# EAGLE design watch_game_2022_revB (EAGLE 8.7.1)
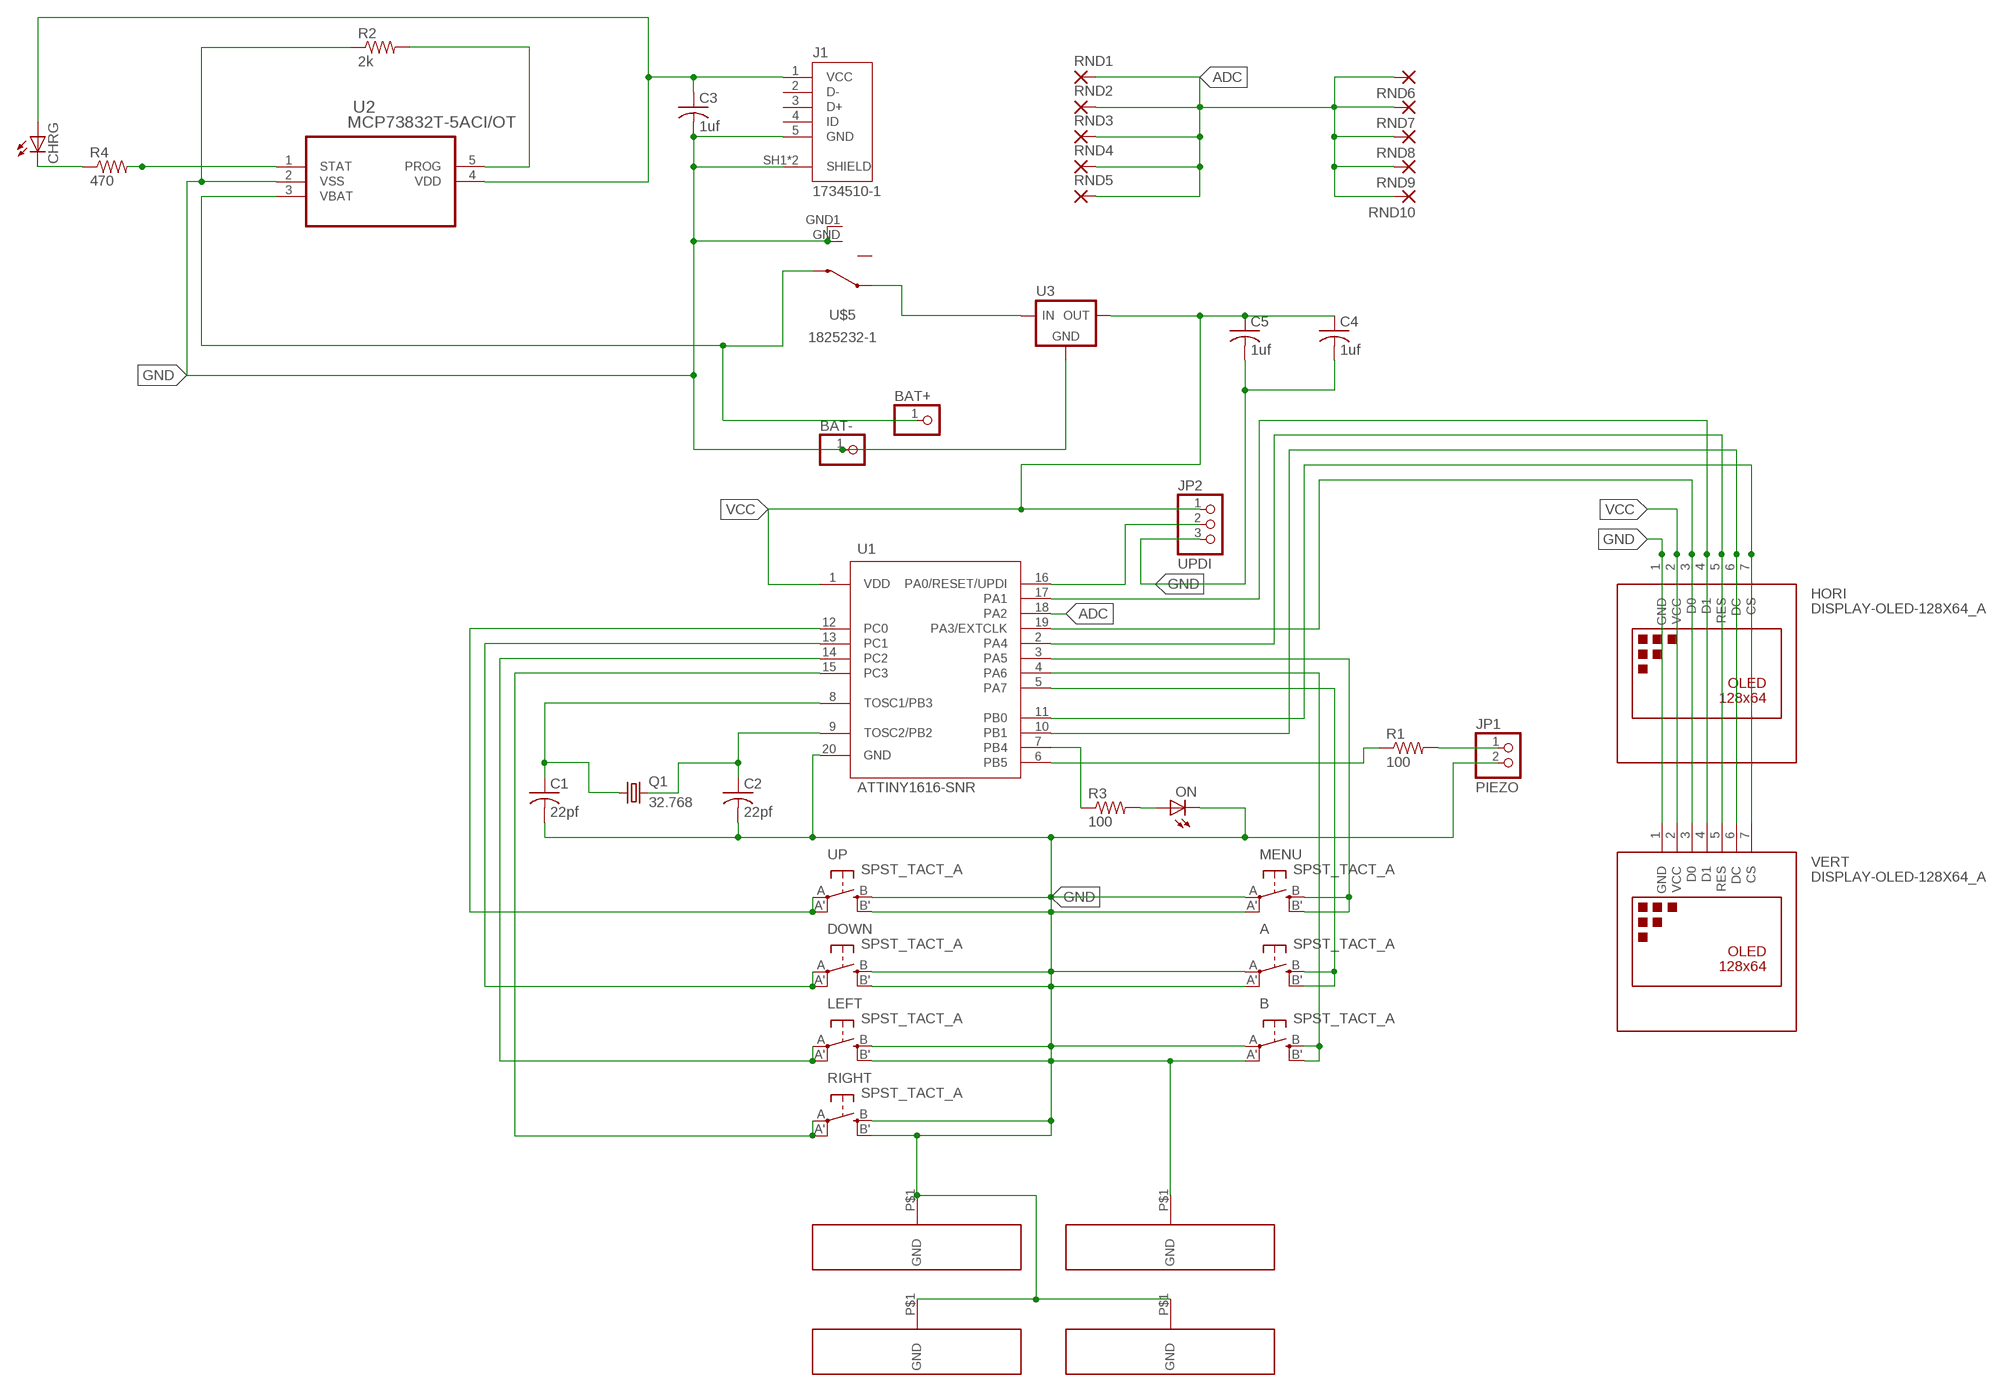
[diagram p0: schematic, sheet 1]

## Parts
A  SPST_TACT_A  [EVQ-Q2_A]
B  SPST_TACT_A  [EVQ-Q2_A]
BAT+  PINHD-1X1  [1X01]
BAT-  PINHD-1X1  [1X01]
C1  22pf  C-USC0805  [C0805]
C2  22pf  C-USC0805  [C0805]
C3  1uf  C-USC0805  [C0805]
C4  1uf  C-USC0805  [C0805]
C5  1uf  C-USC0805  [C0805]
CHRG  LED3MM  [LED3MM]
DOWN  SPST_TACT_A  [EVQ-Q2_A]
HORI  DISPLAY-OLED-128X64_A  [DISPLAY-OLED-128X64_A]
J1  1734510-1  [TE_1734510-1]
JP1  PIEZO  PINHD-1X2  [1X02]
JP2  UPDI  PINHD-1X3  [1X03]
LEFT  SPST_TACT_A  [EVQ-Q2_A]
MENU  SPST_TACT_A  [EVQ-Q2_A]
ON  LED5MM  [LED5MM]
Q1  32.768  CRYSTALTC26H  [TC26H]
R1  100  R-US_M0805  [M0805]
R2  2k  R-US_M0805  [M0805]
R3  100  R-US_M0805  [M0805]
R4  470  R-US_M0805  [M0805]
RIGHT  SPST_TACT_A  [EVQ-Q2_A]
RND1  SMD5  [SMD2,54-5,08]
RND2  SMD5  [SMD2,54-5,08]
RND3  SMD5  [SMD2,54-5,08]
RND4  SMD5  [SMD2,54-5,08]
RND5  SMD5  [SMD2,54-5,08]
RND6  SMD5  [SMD2,54-5,08]
RND7  SMD5  [SMD2,54-5,08]
RND8  SMD5  [SMD2,54-5,08]
RND9  SMD5  [SMD2,54-5,08]
RND10  SMD5  [SMD2,54-5,08]
U1  ATTINY1616-SNR  [SOIC127P1032X265-20N]
U2  MCP73832T-5ACI/OT  [SOT95P300X145-5N]
U3  LF50CDT  [DPAK]
U$5  1825232-1  [1825232-1]
U$6  GND_STRIP_600MIL  [GND_PADS_2]
U$7  GND_STRIP_600MIL  [GND_PADS_2]
U$8  GND_STRIP_600MIL  [GND_PADS_2]
U$9  GND_STRIP_600MIL  [GND_PADS_2]
UP  SPST_TACT_A  [EVQ-Q2_A]
VERT  DISPLAY-OLED-128X64_A  [DISPLAY-OLED-128X64_A]

## Nets
ADC: RND1.1(P) RND2.1(P) RND3.1(P) RND4.1(P) RND5.1(P) RND6.1(P) RND7.1(P) RND8.1(P) RND9.1(P) RND10.1(P) U1.18(PA2)
GND: A.A'(P1) A.A(P) B.A'(P1) B.A(P) BAT-.1 C1.2 C2.2 C3.2 C4.2 C5.2 DOWN.B'(S1) DOWN.B(S) HORI.1(GND) J1.5(GND) J1.SH1(SHIELD) J1.SH2(SHIELD) JP1.2 JP2.3 LEFT.B'(S1) LEFT.B(S) MENU.A'(P1) MENU.A(P) ON.K(C) R2.1 RIGHT.B'(S1) RIGHT.B(S) U1.20(GND) U2.2(VSS) U3.4(GND) U$5.GND U$5.GND1 U$6.P$1(GND) U$7.P$1(GND) U$8.P$1(GND) U$9.P$1(GND) UP.B'(S1) UP.B(S) VERT.1(GND)
N$1: U1.12(PC0) UP.A'(P1) UP.A(P)
N$2: DOWN.A'(P1) DOWN.A(P) U1.13(PC1)
N$3: LEFT.A'(P1) LEFT.A(P) U1.14(PC2)
N$4: RIGHT.A'(P1) RIGHT.A(P) U1.15(PC3)
N$5: B.B'(S1) B.B(S) U1.4(PA6)
N$6: HORI.3(D0) U1.19(PA3/EXTCLK) VERT.3(D0)
N$7: R3.1 U1.7(PB4)
N$8: JP1.1 R1.2
N$9: C3.1 CHRG.A J1.1(VCC) U2.4(VDD)
N$10: U3.1(VIN) U$5.3
N$11: R4.2 U2.1(STAT)
N$12: BAT+.1 U2.3(VBAT) U$5.2
N$13: JP2.2 U1.16(PA0/RESET/UPDI)
N$14: HORI.4(D1) U1.17(PA1) VERT.4(D1)
N$16: HORI.5(RES) U1.2(PA4) VERT.5(RES)
N$17: MENU.B'(S1) MENU.B(S) U1.3(PA5)
N$18: ON.A R3.2
N$19: A.B'(S1) A.B(S) U1.5(PA7)
N$20: HORI.7(CS) U1.11(PB0) VERT.7(CS)
N$21: HORI.6(DC) U1.10(PB1) VERT.6(DC)
N$23: R1.1 U1.6(PB5)
N$24: C1.1 Q1.1 U1.8(TOSC1/PB3)
N$25: C2.1 Q1.2 U1.9(TOSC2/PB2)
N$26: R2.2 U2.5(PROG)
N$27: CHRG.K(C) R4.1
VCC: C4.1 C5.1 HORI.2(VCC) JP2.1 U1.1(VDD) U3.3(VOUT) VERT.2(VCC)
Unconnected: J1.2(D-) J1.3(D+) J1.4(ID) U$5.1

## Library data of the parts
A B DOWN LEFT MENU RIGHT UP = adafruit:SPST_TACT_A: SMT 6mm switch, EVQQ2 series http://www.ladyada.net/library/eagle
BAT+ BAT- = adafruit:PINHD-1X1: Pin header 1x1 for 0.1" spacing With round pins
C1 C2 = adafruit:C-US: CAPACITOR, American symbol
C3-C5 = rcl:C-US: CAPACITOR, American symbol; SPICEPREFIX: C
CHRG = adafruit:LED: LED
HORI VERT = diy-modules:DISPLAY-OLED-128X64_A: 128x64 Dot Matrix OLED Module based on SSD1306 chip Variant with SPI interface More details available here: http://www.instructables.com/id/How-to-use-OLED-display-arduino-module/ SSD1306 datasheet: https://cdn-shop.adafruit.com/datasheets/SSD1306.pdf Click here to find device on ebay.com <http://www.ebay.com/sch/oled+display+128x64> Note: There are two variants: I2C and SPI. Search for the proper version.
J1 = USB 1734510-1:1734510-1: Conn Mini USB Type B RCP 5 POS 1.6mm Solder RA Thru-Hole 5 Terminal 1 Port Tray Check prices <https://pricing.snapeda.com/parts/1734510-1/TE%20Connectivity/view-part?ref=eda>; AVAILABILITY: In Stock; COMMENT: 1734510-1; DESCRIPTION: Conn Mini USB Type B RCP 5 POS 1.6mm Solder RA Thru-Hole 5 Terminal 1 Port Tray; MF: TE Connectivity; MP: 1734510-1; PACKAGE: None; PRICE: None; PURCHASE-URL: https://pricing.snapeda.com/search/part/1734510-1/?ref=eda
JP1 = pinhead:PINHD-1X2: PIN HEADER
JP2 = pinhead:PINHD-1X3: PIN HEADER
ON = led:LED: LED
Q1 = adafruit:CRYSTAL: CRYSTAL; OC_FARNELL: unknown; OC_NEWARK: unknown
R1-R4 = resistor:R-US_: RESISTOR, American symbol
RND1-RND10 = wirepad:SMD5: SMD PAD
U1 = ATTINY1616-SNR:ATTINY1616-SNR: ATTiny1616 is a 20 pin Microcontroller with: - 5 selectable Voltage reference - 8 bit Dac - Multiplexable IOs(SPI, UART, I2C) And much more Datasheet <http://ww1.microchip.com/downloads/en/DeviceDoc/ATtiny1616-3216-DataSheet-DS40001997C.pdf> Check prices <https://pricing.snapeda.com/parts/ATTINY1616-SNR/Microchip/view-part?ref=eda>; AVAILABILITY: In Stock; DESCRIPTION: AVR tinyAVR™ 1, Functional Safety (FuSa) Microcontroller IC 8-Bit 20MHz 16KB (16K x 8) FLASH 20-SOIC; MF: Microchip; MP: ATTINY1616-SNR; PACKAGE: SOIC-20 Microchip; PRICE: None; PURCHASE-URL: https://pricing.snapeda.com/search/part/ATTINY1616-SNR/?ref=eda
U2 = MCP73832T-5ACI_OT:MCP73832T-5ACI/OT: IC, BATT CHARGER, Li-Ion Li-Polymer, 500 mA Check availability <https://pricing.snapeda.com/parts/MCP73832T-5ACI/OT/Microchip/view-part?ref=eda>; AVAILABILITY: In Stock; DESCRIPTION: Charger IC Lithium Ion/Polymer SOT-23-5; MF: Microchip; MP: MCP73832T-5ACI/OT; PACKAGE: SOT-23 Microchip; PRICE: None; PURCHASE-URL: https://pricing.snapeda.com/search/part/MCP73832T-5ACI/OT/?ref=eda
U3 = bt_regulator:LF50CDT: 5V LDO Voltage Regulator Very low-dropout voltage (0.45 V) Very low quiescent current (typ. 50 µA in OFF mode, 500 µA in ON mode) Output current up to 500 mA Logic-controlled electronic shutdown Output voltages of 1.5; 1.8; 2.5; 3.3; 4.7; 5; 6; 8; 8.5; 9; 12 V Automotive grade product: 1.8 V, 2.5 V, 3.3 V 5.0 V, 8.0 V, 8.5 V VOUT in DPAK and PPAK packages Internal current and thermal limit Only 2.2 µF for stability Available in ±1% (AB), ± 1.5% (AC) or ± 2% (C) selection at 25 °C Supply voltage rejection: 80 db (typ.) Temperature range: from -40 to 125 °C The LFxxAB/LFxxC are very low drop regulators available in PENTAWATT, TO-220, TO-220FP, DPAK and PPAK package and in a wide range of output voltages. The very low drop voltage (0.45 V) and the very low quiescent current make them particularly suitable for low noise, low power applications and specially in battery powered systems Datasheet.pdf <http://www.st.com/web/en/resource/technical/document/datasheet/CD00000546.pdf>
U$5 = switch 1825232-1:1825232-1: Check prices <https://pricing.snapeda.com/parts/1825232-1/TE%20Connectivity/view-part?ref=eda>; AVAILABILITY: In Stock; COMMENT: 1825232-1; DESCRIPTION: Switch Slide ON None ON SPDT Side Slide 0.2A 30VDC 10000Cycle PC Pins Bracket Mount/Through Hole; EU_ROHS_COMPLIANCE: Compliant; MF: TE Connectivity; MP: 1825232-1; PACKAGE: None; PRICE: None; PURCHASE-URL: https://pricing.snapeda.com/search/part/1825232-1/?ref=eda
U$6-U$9 = Atari Vagabond:GND_STRIP_600MIL

## Board
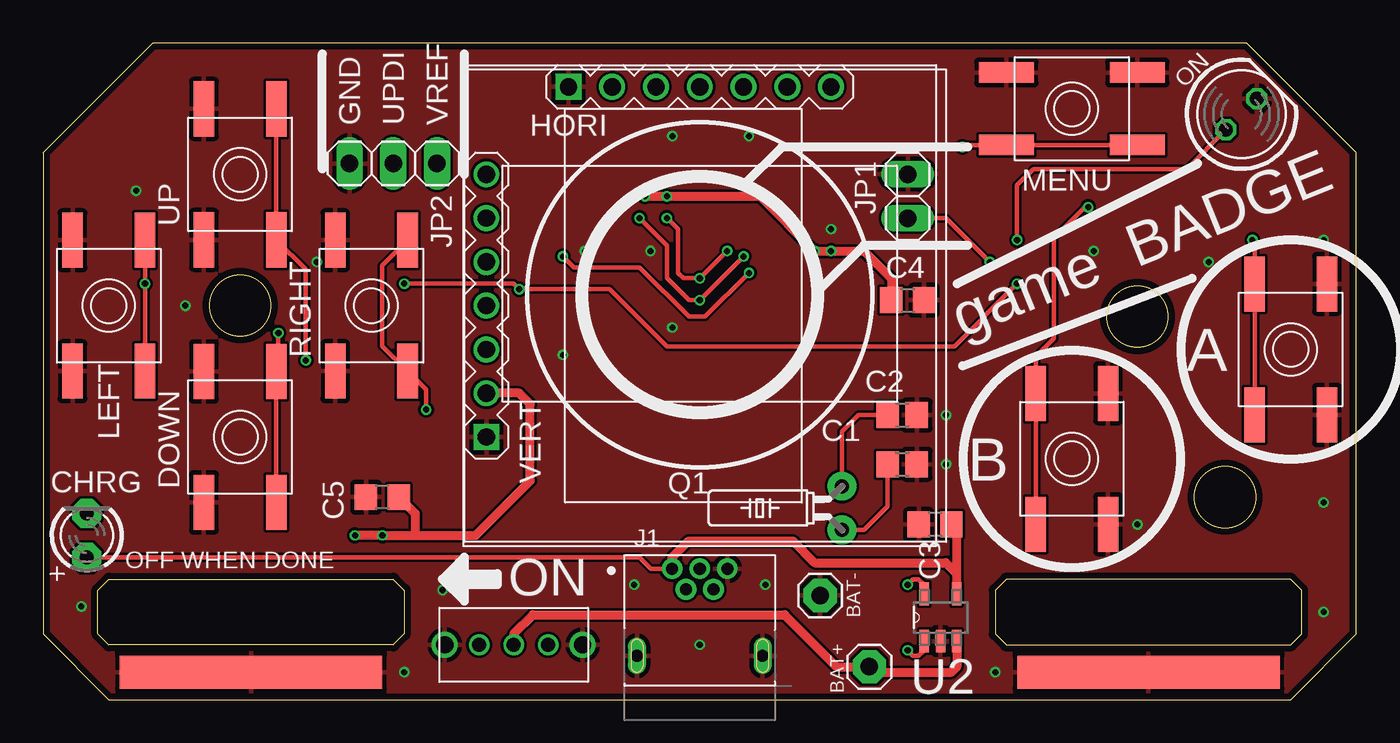
[diagram p1: board, top side]
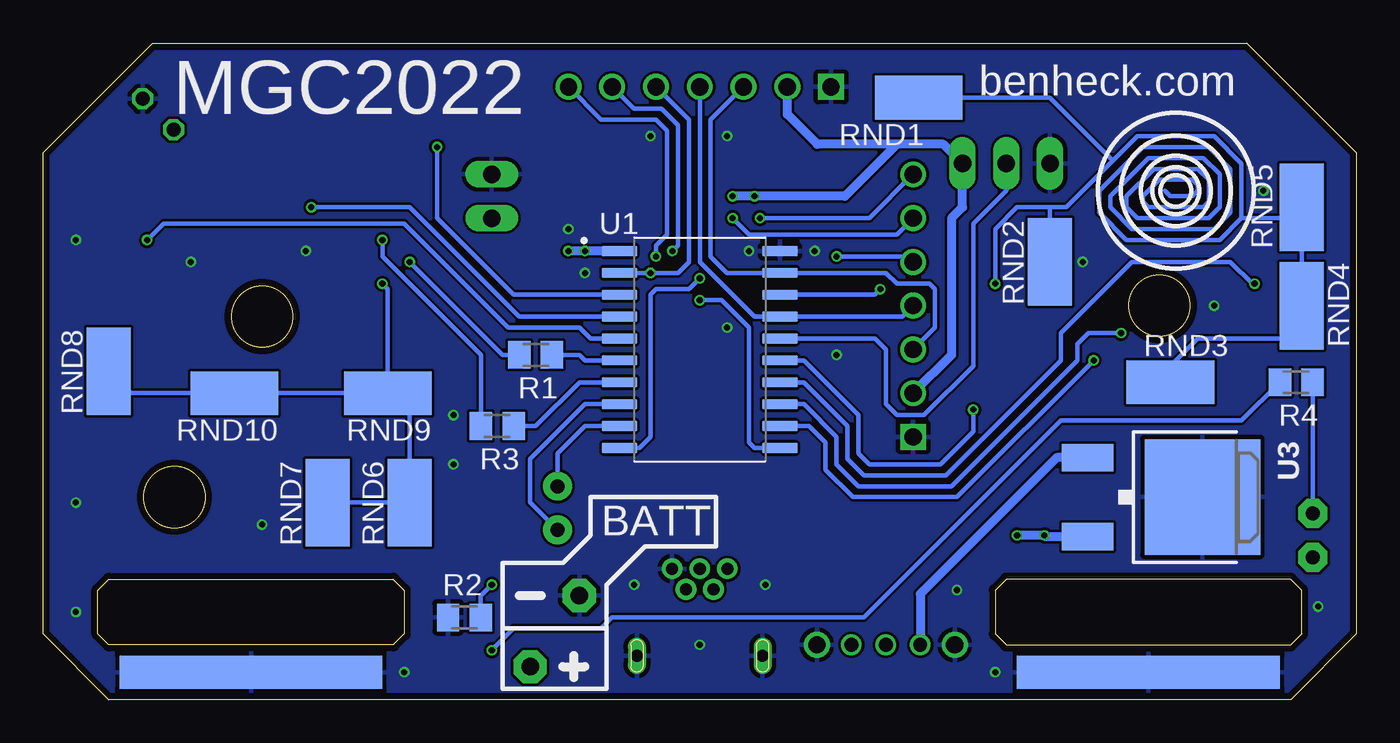
[diagram p2: board, bottom side, seen from below]

Size 76.2 x 38.1 mm. Coordinates in mm from the lower left corner, seen from the top.
Outline: 3.81,0 72.39,0 76.2,3.81 76.2,31.75 69.85,38.1 6.35,38.1 0,31.75 0,3.81 3.81,0
Outline: 3.17,3.81 3.17,6.35 3.81,6.99 20.32,6.99 20.95,6.35 20.95,3.81 20.32,3.17 3.81,3.17 3.17,3.81
Outline: 55.24,6.35 55.24,3.81 55.88,3.17 72.39,3.17 73.03,3.81 73.03,6.35 72.39,6.99 55.88,6.99 55.24,6.35
Outline: circle at 11.43,22.86 radius 1.78
Outline: circle at 68.58,11.75 radius 1.78
Outline: circle at 63.5,22.23 radius 1.78
Copper layers (1*16): Top 0.035559375mm / dielectric 1.6mm / Bottom 0.035559375mm
Design rules "oshpark-2layer": minimum track width 6mil, minimum drill 10mil, track to track 6mil, track to pad 6mil, pad to pad 6mil, via to via 6mil, smd to smd 6mil, copper to edge 15mil, drill to drill 6mil, minimum pad ring 5mil, minimum via ring 5mil, stop-mask expansion 2.5mil, vias tented up to drill 0mil, thermal gap 10mil

### Footprints (pad centres in the part's own frame; a part is rotated, then mirrored left to right if it is on the bottom)
EVQ-Q2_A = smd 3.2 x 1.2: A -3.8,-2.1; A' 3.8,-2.1; B -3.8,2.1; B' 3.8,2.1
1X01 = drill 1.016 pad 1.93 octagon: 1 0,0
C0805 = smd 1.3 x 1.5: 1 -0.85,0; 2 0.85,0
C0805' = smd 1.3 x 1.5: 1 -0.95,0; 2 0.95,0
LED3MM = drill 0.813 pad 1.676 octagon: A -1.27,0; K 1.27,0
DISPLAY-OLED-128X64_A = drill 1 square: 1 -7.62,12.7 | drill 1: 2 -5.08,12.7; 3 -2.54,12.7; 4 0,12.7; 5 2.54,12.7; 6 5.08,12.7; 7 7.62,12.7
TE_1734510-1 = drill 0.7 pad 1.2: 1 -1.6,5.05; 2 -0.8,3.85; 3 0,5.05; 4 0.8,3.85; 5 1.6,5.05 | drill 0.7 long: SH1 3.65,0; SH2 -3.65,0
1X02 = drill 1.016 long: 1 -1.27,0; 2 1.27,0
1X03 = drill 1.016 long: 1 -2.54,0; 2 0,0; 3 2.54,0
LED5MM = drill 0.813 octagon: A -1.27,0; K 1.27,0
TC26H = drill 0.813 pad 1.676: 1 -1.27,0; 2 1.27,0
M0805 = smd 1.3 x 1.6: 1 -0.95,0; 2 0.95,0
SMD2,54-5,08 = smd 2.54 x 5.08: 1 0,0
SOIC127P1032X265-20N = smd 2.05 x 0.6: 1 -4.655,5.715; 2 -4.655,4.445; 3 -4.655,3.175; 4 -4.655,1.905; 5 -4.655,0.635; 6 -4.655,-0.635; 7 -4.655,-1.905; 8 -4.655,-3.175; 9 -4.655,-4.445; 10 -4.655,-5.715; 11 4.655,-5.715; 12 4.655,-4.445; 13 4.655,-3.175; 14 4.655,-1.905; 15 4.655,-0.635; 16 4.655,0.635; 17 4.655,1.905; 18 4.655,3.175; 19 4.655,4.445; 20 4.655,5.715
SOT95P300X145-5N = smd 1.321 x 0.559: 1 -1.372,0.94; 2 -1.372,0; 3 -1.372,-0.94; 4 1.372,-0.94; 5 1.372,0.94
DPAK = smd 1.6 x 3: 1 -2.3,-4.8; 3 2.3,-4.8 | smd 6.7 x 6.7: 4 0,1.86
1825232-1 = drill 0.8: 1 -2,0; 2 0,0; 3 2,0 | drill 1: GND -4,0; GND1 4,0
GND_PADS_2 = smd 15.24 x 1.905: P$1 0,0

### Placement (x,y rotation side)
A  72.39,20.32 90 top
B  59.69,13.97 90 top
BAT+  47.94,1.91 0 top
BAT-  45.09,6.03 0 top
C1  49.85,13.65 0 top
C2  49.85,16.51 0 top
C3  1uf  [C0805']  51.75,10.16 180 top
C4  1uf  [C0805']  50.16,23.18 0 top
C5  1uf  [C0805']  19.68,11.75 180 top
CHRG  2.54,9.53 90 top
DOWN  11.43,15.24 90 top
HORI  38.1,22.86 0 top
J1  38.1,2.54 0 top
JP1  50.16,29.21 90 top
JP2  20.32,31.11 180 top
LEFT  3.81,22.86 90 top
MENU  59.69,34.29 180 top
ON  69.53,33.97 45 top
Q1  46.35,11.11 90 top
R1  47.62,20 180 bottom
R2  51.75,4.76 0 bottom
R3  49.85,15.88 180 bottom
R4  3.49,18.41 180 bottom
RIGHT  19.05,22.86 90 top
RND1  25.4,34.92 90 bottom
RND2  17.78,25.4 0 bottom
RND3  10.79,18.41 270 bottom
RND4  3.17,22.86 180 bottom
RND5  3.17,28.57 180 bottom
RND6  54.93,11.43 0 bottom
RND7  59.69,11.43 0 bottom
RND8  72.39,19.05 0 bottom
RND9  56.2,17.78 90 bottom
RND10  65.09,17.78 90 bottom
U1  38.1,20.32 0 bottom
U2  52.07,4.76 90 top
U3  10.79,11.75 270 bottom
U$5  27.3,3.17 180 top
U$6  12.06,1.59 0 top
U$7  64.14,1.59 0 top
U$8  12.06,1.59 180 bottom
U$9  64.14,1.59 0 bottom
UP  11.43,30.48 90 top
VERT  38.42,22.86 90 top

### Tracks (layer width: path | path; a pad name or v marks a point on that pad's centre or on a via)
ADC  (via drill 0.35)
  Top 0.254: v20.95,24.13 27.3,24.13 v27.62,23.81 32.86,23.81 36.2,20.48 52.86,20.48 v56.52,24.13
  Bottom 0.254: v27.62,23.81 27.94,23.5 U1.18 | 11.11,29.53 10.79,29.21 9.53,29.21 9.21,29.53 9.21,29.84 9.53,30.16 11.43,30.16 12.38,29.21 12.38,28.89 12.06,28.57 8.89,28.57 8.57,28.89 8.57,30.16 9.21,30.8 11.75,30.8 13.34,29.21 13.34,28.57 12.7,27.94 8.57,27.94 7.94,28.57 7.94,30.48 8.89,31.43 12.06,31.43 14.29,29.21 14.29,28.57 13.02,27.3 8.26,27.3 7.3,28.26 7.3,30.8 8.57,32.07 12.38,32.07 14.92,29.53 14.92,28.26 13.34,26.67 7.94,26.67 6.67,27.94 | v20.95,24.13 20.95,27.3 19.68,28.57 17.78,28.57 | 14.13,31.27 12.7,32.7 8.26,32.7 6.67,31.11 6.67,27.94 | 14.13,31.27 16.83,28.57 17.78,28.57 | 17.78,28.57 RND2.1 | 6.67,27.94 3.17,27.94 RND5.1 RND4.1 3.17,20.95 9.21,20.95 10.79,19.37 RND3.1 | RND9.1 54.93,16.51 RND6.1 RND7.1 | RND9.1 RND10.1 71.12,17.78 RND8.1 | RND9.1 56.2,23.81 v56.52,24.13 | RND1.1 17.78,34.92 14.13,31.27
GND  (via drill 0.35)
  other vias: 5.4,29.53 35.24,26.04 31.43,26.04 36.51,21.59 23.18,6.35 63.5,10.16 38.1,3.17 34.29,6.67 41.91,6.67 40.96,32.7 36.51,32.7 55.24,1.59 52.39,13.65 52.39,16.51 8.26,22.86 15.88,25.4 74.3,11.43 30.16,20 44.77,24.77 60.96,26.04 45.72,27.3 74.3,5.08 2.22,5.4 20.95,1.59 67.63,25.4 74.3,26.67
  pour Top: 92.71,48.58 92.71,-13.34 88.9,-17.14 -8.89,-17.14 -15.56,-10.48 -15.56,46.35 -10.16,51.75 89.53,51.75
  pour Bottom: -8.89,54.61 84.77,54.61 96.84,42.55 96.84,-0.32 84.14,-13.02 -8.26,-13.02 -12.06,-9.21 -12.06,51.44
N$1  (via drill 0.35)
  Top 0.254: UP.A' UP.A 15.24,24.97 v15.24,19.68
  Bottom 0.254: U1.12 31.75,15.88 30.8,14.92 30.8,13.34 29.21,11.75 23.18,11.75 v15.24,19.68
N$2  (via drill 0.35)
  Top 0.254: 13.53,16.39 DOWN.A DOWN.A' 13.65,18.92 v13.65,21.27
  Bottom 0.254: U1.13 32.07,17.14 30.16,15.24 30.16,13.65 28.89,12.38 23.5,12.38 16.19,19.68 16.19,20.64 15.56,21.27 v13.65,21.27
N$3  (via drill 0.35)
  Top 0.254: LEFT.A' v5.91,24.13 LEFT.A 5.91,17.98 5.71,17.78
  Bottom 0.254: U1.14 32.07,18.41 29.53,15.88 29.53,13.97 28.57,13.02 23.81,13.02 17.14,19.68 17.14,21.27 13.02,25.4 7.3,25.4 6.03,24.13 v5.91,24.13
N$4  (via drill 0.35)
  Top 0.254: RIGHT.A 21.27,18.93 | RIGHT.A 19.68,20.52 19.68,25.2 RIGHT.A' | v22.23,16.83 22.23,17.98 RIGHT.A
  Bottom 0.254: U1.15 32.07,19.68 28.89,16.51 28.89,14.29 28.26,13.65 24.13,13.65 22.23,15.56 v22.23,16.83
N$5  (via drill 0.35)
  Top 0.254: B.B B.B' 57.59,19.91 58.64,20.95 58.64,26.77 60.45,28.57 v60.64,28.57
  Bottom 0.254: U1.4 48.58,22.23 54.93,28.57 v60.64,28.57
N$6
  Bottom 0.254: VERT.3 24.45,21.59 24.45,23.81 24.77,24.13 26.67,24.13 27.3,24.77 U1.19 36.51,24.77 37.47,25.72 37.47,33.66 HORI.3
N$7
  Bottom 0.254: U1.7 45.09,18.41 47.62,15.88 R3.1
N$8  (via drill 0.35)
  Top 0.254: v54.93,25.4 52.39,27.94 JP1.1
  Bottom 0.254: R1.2 49.53,20 v54.93,25.4
N$9
  Top 0.254: CHRG.A 34.61,8.26 35.27,7.59 J1.1
  Top 0.508: U2.4 53.01,7.3 | 53.01,7.3 53.01,9.85 C3.1 | 53.01,7.3 52.38,7.94 44.77,7.94 43.5,9.21 42.23,9.21 37.45,9.21 36.5,8.26 J1.1
N$10
  Bottom 0.508: U3.1 17.39,14.05 25.3,6.13 U$5.3
N$11  (via drill 0.35)
  Top 0.254: U2.1 51.13,2.87 50.8,2.54 50.48,2.54 v50.16,2.86
  Bottom 0.254: R4.2 6.67,16.19 17.14,16.19 28.57,4.76 43.18,4.76 43.81,4.13 48.9,4.13 v50.16,2.86
N$12
  Top 0.508: U$5.2 27.3,3.81 28.42,4.92 43.02,4.92 46.04,1.91 BAT+.1 48.26,1.59 52.7,1.59 53.01,1.89 U2.3
N$13
  Bottom 0.254: JP2.2 20.32,29.53 22.23,27.62 22.23,19.37 25.08,16.51 26.67,16.51 27.3,17.14 27.3,20.32 27.94,20.95 U1.16
N$14
  Bottom 0.254: VERT.4 26.35,22.23 U1.17 34.92,22.23 38.1,25.4 HORI.4
N$16  (via drill 0.35)
  Top 0.254: v40.96,24.77 38.42,22.23 37.47,22.23 34.61,25.08 30.8,25.08 v30.16,25.72
  Bottom 0.254: U1.2 v40.96,24.77 39.37,24.77 38.73,25.4 38.73,33.66 HORI.5 | VERT.5 26.04,25.72 v30.16,25.72
N$17  (via drill 0.35)
  Top 0.254: MENU.B MENU.B' 53.46,32.19 v53.34,32.07
  Bottom 0.254: v53.34,32.07 53.34,27.94 48.9,23.5 U1.3
N$18  (via drill 0.35)
  Top 0.254: v56.52,26.67 56.52,29.84 57.47,30.8 66.36,30.8 ON.A
  Bottom 0.254: R3.2 50.8,20 56.52,25.72 v56.52,26.67
N$19  (via drill 0.35)
  Top 0.254: v70.17,26.67 70.29,26.55 A.B' A.B
  Bottom 0.254: U1.5 44.45,20.95 45.09,21.59 49.21,21.59 55.24,27.62 69.22,27.62 v70.17,26.67
N$20  (via drill 0.35)
  Top 0.254: v40.64,25.72 v38.1,23.18 37.47,23.18 36.2,24.45 36.2,26.35 v34.61,27.94
  Bottom 0.254: U1.11 34.92,14.61 35.24,14.92 35.24,21.59 36.83,23.18 v38.1,23.18 | v40.64,25.72 40.64,26.35 40.01,26.99 40.01,30.48 39.99,31.11 39.99,33.01 40.64,33.66 43.81,33.66 HORI.7 | v34.61,27.94 28.26,27.94 VERT.7
N$21  (via drill 0.35)
  Top 0.254: v39.69,26.04 v38.1,24.45 37.15,24.45 36.83,24.77 36.83,27.3 v36.2,27.94
  Bottom 0.254: v39.69,26.04 39.37,26.35 39.37,33.34 40.32,34.29 41.91,34.29 HORI.6 | U1.10 41.59,14.61 40.96,15.24 40.96,23.5 40.64,23.81 38.73,23.81 v38.1,24.45 | v36.2,27.94 35.24,26.99 26.67,26.99 VERT.6
N$23
  Bottom 0.254: U1.6 44.77,19.68 45.09,20 R1.1
N$24
  Top 0.254: Q1.1 47.62,9.84 49,11.21 C1.1
  Bottom 0.254: U1.8 44.77,17.14 47.94,13.97 47.94,11.43 Q1.1
N$25
  Top 0.254: Q1.2 46.35,15.56 47.31,16.51 C2.1
  Bottom 0.254: U1.9 44.77,15.88 46.35,14.29 Q1.2
N$26  (via drill 0.35)
  Top 0.254: U2.5 51.13,6.66 50.8,6.99 50.48,6.99 v50.16,6.67
  Bottom 0.254: R2.2 50.8,6.03 v50.16,6.67
N$27
  Bottom 0.254: CHRG.K R4.1
VCC  (via drill 0.35)
  Top 0.508: v34.92,29.21 v36.2,29.21 41.59,29.21 v44.77,26.04 v45.72,26.04 47.62,26.04 49.22,24.45 C4.1 | v18.1,9.53 v19.68,9.53 21.59,9.53 | 21.59,9.53 25.08,9.53 28.26,12.7 28.26,17.14 27.62,17.78 VERT.2 | C5.1 21.59,10.79 21.59,9.53
  Bottom 0.508: 26.67,32.23 23.97,32.23 JP2.1 22.86,28.57 23.5,27.94 23.5,20 VERT.2 | 26.67,32.23 29.69,29.21 v34.92,29.21 v36.2,29.21 | 26.67,32.23 31.27,32.23 33.02,33.97 HORI.2 | U1.1 v44.77,26.04 v45.72,26.04 | U3.3 18.02,9.45 v18.1,9.53 v19.68,9.53

### Text on the board
tPlace: GND | UPDI | VREF | game BADGE | OFF WHEN DONE | ON
bPlace: benheck.com | MGC2022 | BATT